# Altium schematic sheet Trimmer 1K.schdoc
size 127 x 101 mm
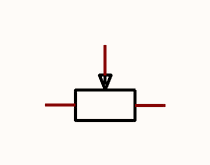
[diagram p0: Trimmer 1K.schdoc]

## Parts
U?  WH06-2C-102(1K)  [RES-ADJ-TH_VZ067TL1B202]  (value not drawn)

## Nets

Not connected (* = marked no-connect by the designer): U? 1 2 3

## Library data of the parts
U? = WH06-2C-102(1K): Manufacturer: BOCHEN(博晨); Add into BOM: yes; Value: 1kΩ; Tolerance: ±25%; Symbol: WH06-2C-102(1K); Device: WH06-2C-102(1K); LCSC Part Name: 1kΩ ±25%; Supplier Part: C5205040; Manufacturer Part: WH06-2C-102(1K); Supplier Footprint: 插件; JLCPCB Part Class: Extended Part; Datasheet: https://atta.szlcsc.com/upload/public/pdf/source/20221019/683A1EE763180882FA5E0C1228474CEE.pdf; Supplier: LCSC; Convert to PCB: yes